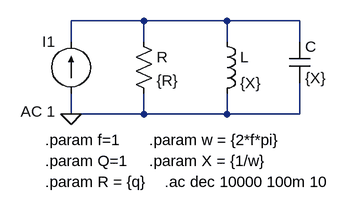
[diagram p0: schematic Circuito RLC en paralelo corregido .asc]
Circuito RLC en paralelo corregido .asc, the LTspice schematic file:
Version 4
SHEET 1 880 680
WIRE 112 96 0 96
WIRE 240 96 112 96
WIRE 352 96 240 96
WIRE 0 128 0 96
WIRE 112 128 112 96
WIRE 240 128 240 96
WIRE 352 128 352 96
WIRE 0 240 0 208
WIRE 112 240 112 208
WIRE 112 240 0 240
WIRE 240 240 240 208
WIRE 240 240 112 240
WIRE 352 240 352 192
WIRE 352 240 240 240
FLAG 0 240 0
SYMBOL res 96 112 R0
SYMATTR InstName R
SYMATTR Value {R}
SYMBOL ind 224 112 R0
SYMATTR InstName L
SYMATTR Value {X}
SYMBOL cap 336 128 R0
SYMATTR InstName C
SYMATTR Value {X}
SYMBOL current 0 208 R180
WINDOW 0 24 80 Left 2
WINDOW 3 24 0 Left 2
WINDOW 123 24 -28 Left 2
WINDOW 39 0 0 Left 0
SYMATTR InstName I1
SYMATTR Value ""
SYMATTR Value2 AC 1
TEXT -40 280 Left 2 !.param f=1
TEXT 120 280 Left 2 !.param w = {2*f*pi}
TEXT -40 312 Left 2 !.param Q=1
TEXT 120 312 Left 2 !.param X = {1/w}
TEXT 144 344 Left 2 !.ac dec 10000 100m 10
TEXT -40 344 Left 2 !.param R = {q}

The netlist it stands for:
* Circuito RLC en paralelo corregido .asc
R N001 0 {R}
L N001 0 {X}
C N001 0 {X}
I1 0 N001 AC 1
.param f=1
.param w = {2*f*pi}
.param Q=1
.param X = {1/w}
.ac dec 10000 100m 10
.param R = {q}
.backanno
.end